# EasyEDA schematic SCH_ASUS-TUF-A16-USB-HUB_2024-04-18.json
TITLE: USB-C to 4 USB-A Hub; REV: 1.0; Date: 2024-04-18; Sheet: 1/1; Company: Blaze Coding
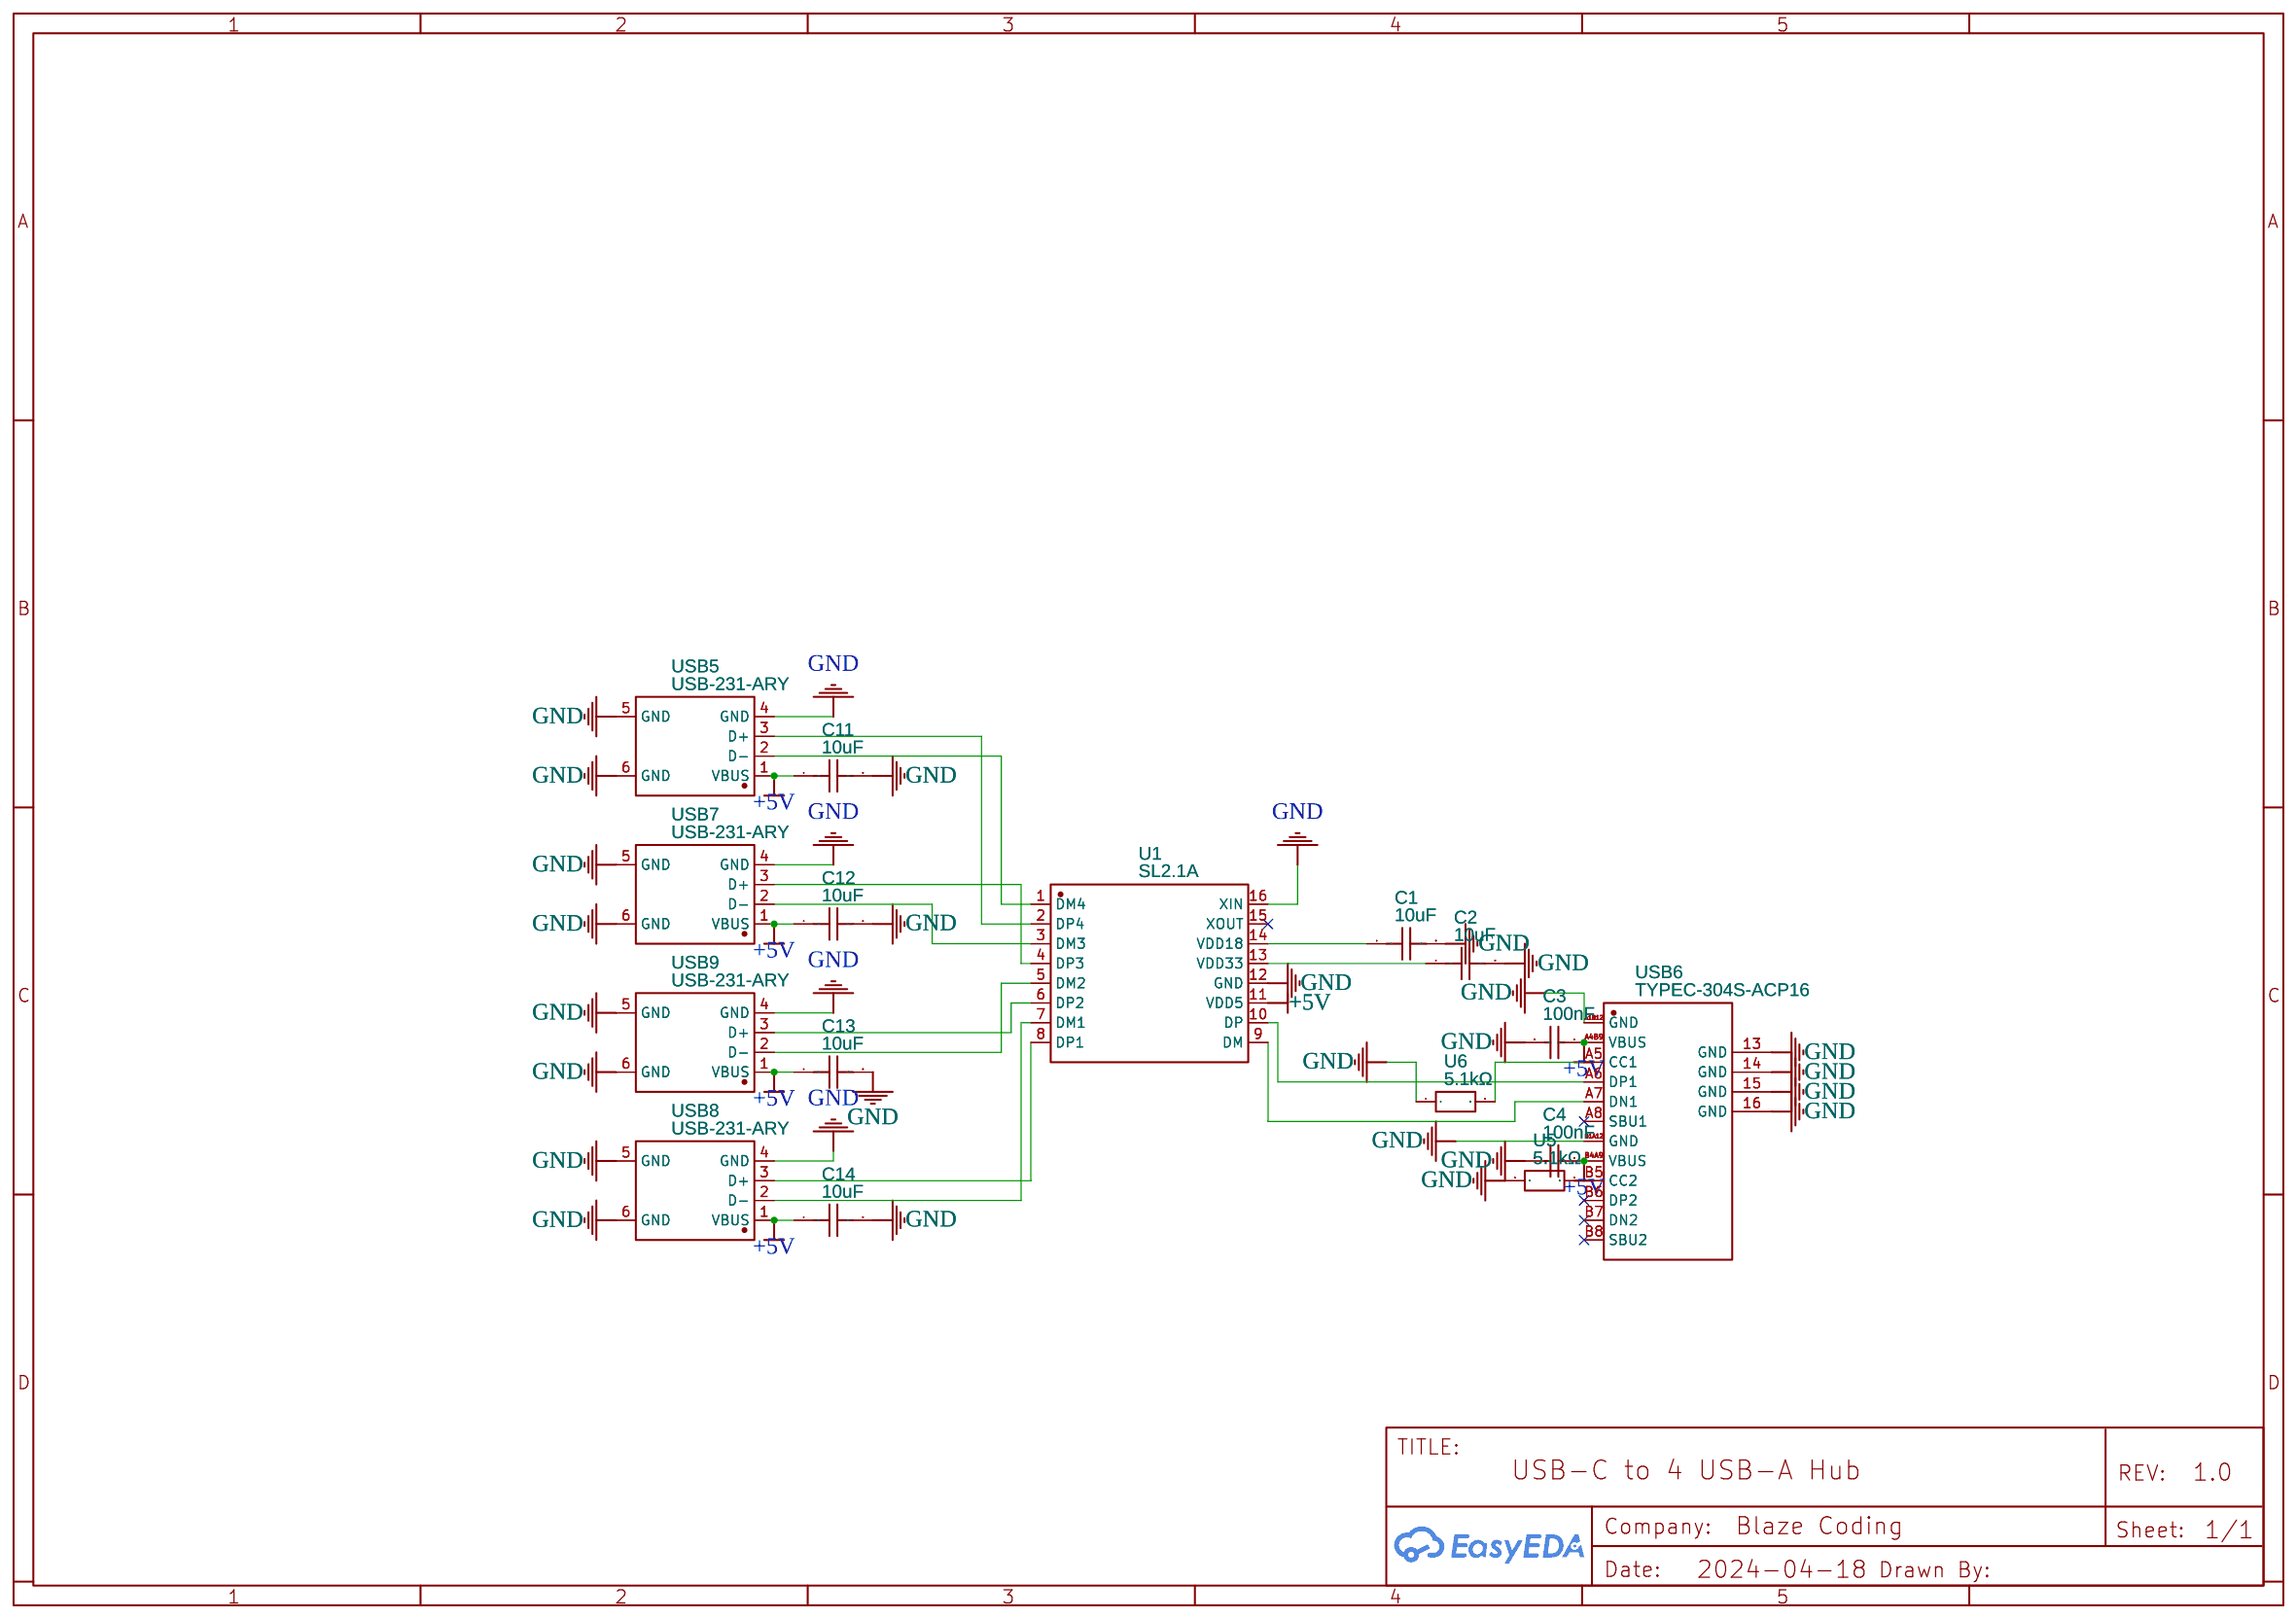
[diagram p0: schematic sheet]

## Parts
C1  10uF  [C0603]
C2  10uF  [C0603]
C3  100nF  [C0805]
C4  100nF  [C0805]
C11  10uF  [C0603]
C12  10uF  [C0603]
C13  10uF  [C0603]
C14  10uF  [C0603]
U1  SL2.1A  [SOP-16_L10.0-W3.9-P1.27-LS6.0-BL]
U5  5.1kΩ  [R0603]
U6  5.1kΩ  [R0603]
USB5  USB-231-ARY  [USB-A-TH_USB-231-ARY]
USB6  TYPEC-304S-ACP16  [USB-C-SMD_TYPEC-304S-ACP16]
USB7  USB-231-ARY  [USB-A-TH_USB-231-ARY]
USB8  USB-231-ARY  [USB-A-TH_USB-231-ARY]
USB9  USB-231-ARY  [USB-A-TH_USB-231-ARY]

## Library data of the parts
C1 C2 C11-C14 = ZRB18AR61E106ME01L: Contributor: lcsc; Supplier: LCSC; Supplier Part: C913517; Manufacturer: muRata(村田); JLCPCB Part Class: Extended Part
C3 C4 = TCC0805X7R104M500DT: Contributor: LCSC; Supplier: LCSC; Supplier Part: C360619; Manufacturer: CCTC(三环); JLCPCB Part Class: Extended Part
U1 = SL2.1A: Contributor: LCSC; Supplier: LCSC; Supplier Part: C192893; Manufacturer: CoreChips(和芯润德); JLCPCB Part Class: Extended Part
U5 U6 = HOARG0603-1/10W-5.1KR-0.1%-TCR25: Supplier: LCSC; Supplier Part: C5123614; Manufacturer: Milliohm(毫欧); Manufacturer Part: HoARG0603-1/10W-5.1KR-0.1%-TCR25; JLCPCB Part Class: Extended Part; Contributor: lcsc
USB5 USB7-USB9 = USB-231-ARY: Contributor: LCSC; Supplier: LCSC; Supplier Part: C720525; Manufacturer: XUNPU(讯普); JLCPCB Part Class: Extended Part
USB6 = TYPEC-304S-ACP16: Contributor: LCSC; Supplier: LCSC; Supplier Part: C720630; Manufacturer: XUNPU(讯普); JLCPCB Part Class: Extended Part

## Nets
+5V: C3.1 C4.1 C11.1 C12.1 C13.1 C14.1 U1.11(VDD5) USB5.1(VBUS) USB6.A4B9(VBUS) USB6.B4A9(VBUS) USB7.1(VBUS) USB8.1(VBUS) USB9.1(VBUS)
GND: C1.2 C2.2 C3.2 C4.2 C11.2 C12.2 C13.2 C14.2 U1.12(GND) U1.16(XIN) U5.1 U6.1 USB5.4(GND) USB5.5(GND) USB5.6(GND) USB6.13(GND) USB6.14(GND) USB6.15(GND) USB6.16(GND) USB6.A1B12(GND) USB6.B1A12(GND) USB7.4(GND) USB7.5(GND) USB7.6(GND) USB8.4(GND) USB8.5(GND) USB8.6(GND) USB9.4(GND) USB9.5(GND) USB9.6(GND)
Net-(C1-1): C1.1 U1.14(VDD18)
Net-(C2-1): C2.1 U1.13(VDD33)
Net-(U1-1): U1.1(DM4) USB5.2(D-)
Net-(U1-2): U1.2(DP4) USB5.3(D+)
Net-(U1-3): U1.3(DM3) USB7.2(D-)
Net-(U1-4): U1.4(DP3) USB7.3(D+)
Net-(U1-5): U1.5(DM2) USB9.2(D-)
Net-(U1-6): U1.6(DP2) USB9.3(D+)
Net-(U1-7): U1.7(DM1) USB8.2(D-)
Net-(U1-8): U1.8(DP1) USB8.3(D+)
Net-(U1-9): U1.9(DM) USB6.A7(DN1)
Net-(U1-10): U1.10(DP) USB6.A6(DP1)
Net-(U5-2): U5.2 USB6.B5(CC2)
Net-(U6-2): U6.2 USB6.A5(CC1)

Not connected (* = marked no-connect by the designer): U1 15(XOUT)*; USB6 A8(SBU1)* B6(DP2)* B7(DN2)* B8(SBU2)*
